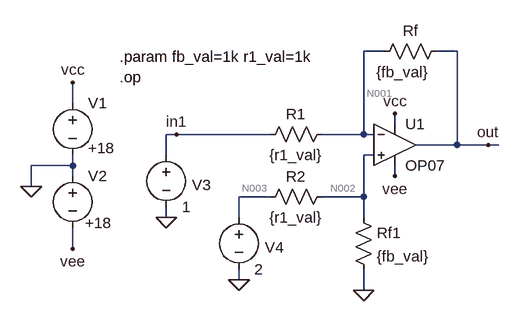
[diagram p0: schematic 10-subtractor.asc]
10-subtractor.asc, the LTspice schematic file:
Version 4
SHEET 1 880 680
WIRE 272 -64 240 -64
WIRE 384 -64 352 -64
WIRE -208 16 -208 -16
WIRE 288 48 288 32
WIRE -48 64 -64 64
WIRE 96 64 -48 64
WIRE 240 64 240 -64
WIRE 240 64 176 64
WIRE 256 64 240 64
WIRE 384 80 384 -64
WIRE 384 80 320 80
WIRE 432 80 384 80
WIRE 448 80 432 80
WIRE -64 96 -64 64
WIRE 256 96 240 96
WIRE -208 112 -208 96
WIRE -208 112 -272 112
WIRE -208 128 -208 112
WIRE 288 128 288 112
WIRE -272 144 -272 112
WIRE 96 160 48 160
WIRE 240 160 240 96
WIRE 240 160 176 160
WIRE -64 192 -64 176
WIRE 48 192 48 160
WIRE 240 192 240 160
WIRE -208 240 -208 208
WIRE 48 288 48 272
WIRE 240 304 240 272
FLAG -272 144 0
FLAG -208 -16 vcc
FLAG -208 240 vee
FLAG -64 192 0
FLAG -48 64 in1
FLAG 288 128 vee
FLAG 288 32 vcc
FLAG 432 80 out
FLAG 240 304 0
FLAG 48 288 0
DATAFLAG 384 -32 ""
DATAFLAG 240 -32 ""
DATAFLAG 0 64 ""
DATAFLAG 64 160 ""
SYMBOL OpAmps\\OP07 288 16 R0
SYMATTR InstName U1
SYMBOL voltage -208 0 R0
WINDOW 3 24 85 Left 2
WINDOW 123 0 0 Left 0
WINDOW 39 0 0 Left 0
SYMATTR Value +18
SYMATTR InstName V1
SYMBOL voltage -208 112 R0
WINDOW 3 19 88 Left 2
WINDOW 123 0 0 Left 0
WINDOW 39 0 0 Left 0
SYMATTR Value +18
SYMATTR InstName V2
SYMBOL res 368 -80 R90
WINDOW 0 0 56 VBottom 2
WINDOW 3 32 68 VTop 2
SYMATTR InstName Rf
SYMATTR Value {fb_val}
SYMBOL res 192 48 R90
WINDOW 0 0 56 VBottom 2
WINDOW 3 32 56 VTop 2
SYMATTR InstName R1
SYMATTR Value {r1_val}
SYMBOL voltage -64 80 R0
WINDOW 0 40 62 Left 2
WINDOW 123 0 0 Left 0
WINDOW 39 0 0 Left 0
SYMATTR InstName V3
SYMATTR Value 1
SYMBOL res 192 144 R90
WINDOW 0 0 56 VBottom 2
WINDOW 3 32 56 VTop 2
SYMATTR InstName R2
SYMATTR Value {r1_val}
SYMBOL res 224 176 R0
SYMATTR InstName Rf1
SYMATTR Value {fb_val}
SYMBOL voltage 48 176 R0
WINDOW 0 40 62 Left 2
WINDOW 123 0 0 Left 0
WINDOW 39 0 0 Left 0
SYMATTR InstName V4
SYMATTR Value 2
TEXT -136 -56 Left 2 !.param fb_val=1k r1_val=1k
TEXT -136 -24 Left 2 !.op

The netlist it stands for:
* 10-subtractor.asc
XU1 N002 N001 vcc vee out LT1001  ; OP07, pins In+ In- V+ V- OUT
V1 vcc 0 +18
V2 0 vee +18
Rf out N001 {fb_val}
R1 N001 in1 {r1_val}
V3 in1 0 1
R2 N002 N003 {r1_val}
Rf1 N002 0 {fb_val}
V4 N003 0 2
.param fb_val=1k r1_val=1k
.op
.lib LTC.lib
.backanno
.end

* Results of the author's LTspice run, read from the files saved beside the schematic
* Operating Point:
*   V(n001) = 1 V
*   V(n002) = 1 V
*   V(vcc) = 18 V
*   V(vee) = -18 V
*   V(out) = 1 V
*   V(in1) = 1 V
*   V(n003) = 2 V
*   I(Rf) = -1.339 nA
*   I(R1) = -1.341 nA
*   I(R2) = -1 mA
*   I(Rf1) = 1 mA
*   I(V1) = -2.25 mA
*   I(V2) = -2.25 mA
*   I(V3) = -1.341 nA
*   I(V4) = -1 mA
*   Ix(u1:1) = 1.804 pA
*   Ix(u1:2) = 1.768 pA
*   Ix(u1:3) = 2.25 mA
*   Ix(u1:4) = -2.25 mA
*   Ix(u1:5) = 1.337 nA